# EAGLE schematic LTC3092_BREAKOUT (EAGLE 7.2.0)
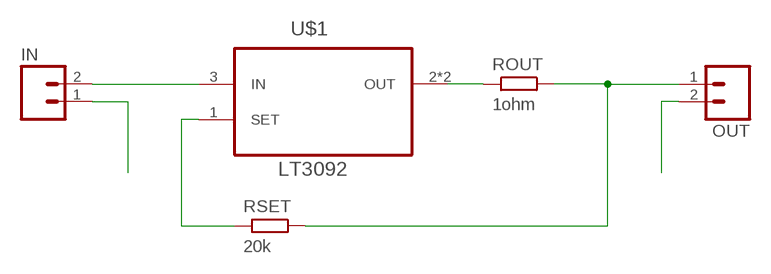
[diagram p0: schematic, sheet 1]

## Parts
IN  M02PTH  [1X02]
OUT  M02PTH  [1X02]
ROUT  1ohm  RESISTOR0603-N  [R0603-N]
RSET  20k  RESISTOR0603-N  [R0603-N]
U$1  LT3092  [SOT223]

## Nets
GND: IN.1 OUT.2
N$1: IN.2 U$1.3(IN)
N$3: RSET.1 U$1.1(SET)
N$4: OUT.1 ROUT.2 RSET.2
N$5: ROUT.1 U$1.2(OUT) U$1.4(OUT)

## Library data of the parts
IN OUT = SparkFun-Connectors:M02: Standard 2-pin 0.1" header. Use with - straight break away headers ( PRT-00116) - right angle break away headers (PRT-00553) - swiss pins (PRT-00743) - machine pins (PRT-00117) - female headers (PRT-00115) Molex polarized connector foot print use with: PRT-08233 with associated crimp pins and housings. 2.54_SCREWTERM for use with PRT-10571. 3.5mm Screw Terminal footprints for PRT-08084 5mm Screw Terminal footprints for use with PRT-08432
ROUT RSET = passives-7351:RESISTOR
U$1 = _my-parts:LT3092